# Altium schematic sheet psu.SchDoc
size A4
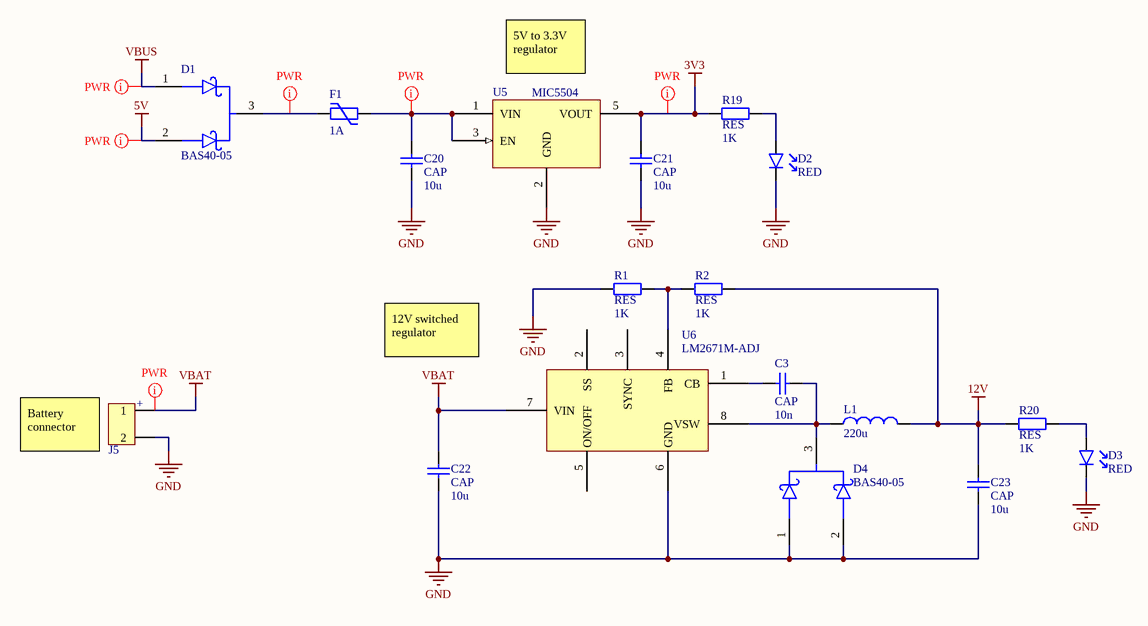
[diagram p0: psu.SchDoc]

## Parts
C3  CAP  value 10n  [CAPC1608X08M]
C20  CAP  value 10u  [CAPC2012X11M]
C21  CAP  value 10u  [CAPC2012X11M]
C22  CAP  value 10u  [CAPC3216X14M]
C23  CAP  value 10u  [CAPC3216X14M]
D1  BAS40-05  [SOT23]
D2  RED  [RESC1608X06M]
D3  RED  [RESC1608X06M]
D4  BAS40-05  [SOT23]
F1  value 1A  [RESC3216X07M]  (hidden comment: POLYFUSE)
J5  VBAT  [BAT_CNCTR]  (value not drawn)
L1  value 220u  [INDC3924X34M]  (hidden comment: IND)
R1  RES  value 1K  [RESC1608X06M]
R2  RES  value 1K  [RESC1608X06M]
R19  RES  value 1K  [RESC1608X06M]
R20  RES  value 1K  [RESC1608X06M]
U5  MIC5504  [SOT23-5]
U6  LM2671M-ADJ  [AGV_SO-8]

## Nets
3V3: C21.2 R19.1 U5.5(VOUT)
5V: D1.2(A2)
12V: C23.2 L1.2 R2.2 R20.1
GND: C20.1 C21.1 C22.1 C23.1 D2.2(K) D3.2(K) D4.1(A1) D4.2(A2) J5.2 R1.1 U5.2(GND) U6.6(GND)
VBAT: C22.2 J5.1 U6.7(VIN)
VBUS: D1.1(A1)
NetC3_1: C3.1 D4.3(K) L1.1 U6.8(VSW)
NetC3_2: C3.2 U6.1(CB)
NetC20_2: C20.2 F1.1 U5.1(VIN) U5.3(EN)
NetD1_3: D1.3(K) F1.2
NetD2_1: D2.1(A1) R19.2
NetD3_1: D3.1(A1) R20.2
NetR1_2: R1.2 R2.1 U6.4(FB)

Not connected (* = marked no-connect by the designer): U6 2(SS) 3(SYNC) 5(ON/OFF)

## Layout directives
rule Width Constraint [Pref Width = 0.75mm    Min Width = 0.4mm    Max Width = 5mm]: 3V3, 5V, NetC20_2, NetD1_3, VBAT, VBUS

## Notes on the sheet
- (near U5) 5V to 3.3V regulator
- 12V switched regulator
- (near J5) Battery connector
- (in symbol BAT_CNCTR) +

## Library data of the parts
C3 C20-C23 = CAP: Capacitor; Published: 8-Jun-2000; LatestRevisionDate: 17-Jul-2002; LatestRevisionNote: Re-released for DXP Platform.; PackageReference: RB7.6-15; Publisher: Altium Limited; PackageDescription: Polarized Capacitor (Radial); 2 Leads
D2 D3 = LED
J5 = BAT_CNCTR: 2-pin batteri kontakt
L1 = AGV_IND: Inductor; Published: 8-Jun-2000; LatestRevisionDate: 17-Jul-2002; LatestRevisionNote: Re-released for DXP Platform.; PackageReference: AXIAL-0.4; Publisher: Altium Limited; PackageDescription: Axial Device, Thru-Hole; 2 Leads; 0.4 in Pin Spacing
R1 R2 R19 R20 = RES: Resistor; Published: 8-Jun-2000; LatestRevisionDate: 17-Jul-2002; LatestRevisionNote: Re-released for DXP Platform.; PackageReference: AXIAL-0.4; Publisher: Altium Limited; PackageDescription: Axial Device, Thru-Hole; 2 Leads; 0.4 in Pin Spacing
U5 = MIC5504-3.3
U6 = LM2671M
F1 = POLYFUSE: Published: 8-Jun-2000; LatestRevisionDate: 17-Jul-2002; LatestRevisionNote: Re-released for DXP Platform.; PackageReference: AXIAL-0.4; Publisher: Altium Limited; PackageDescription: Axial Device, Thru-Hole; 2 Leads; 0.4 in Pin Spacing